# EAGLE design kelvin_1wire_B (EAGLE 6.6.0)
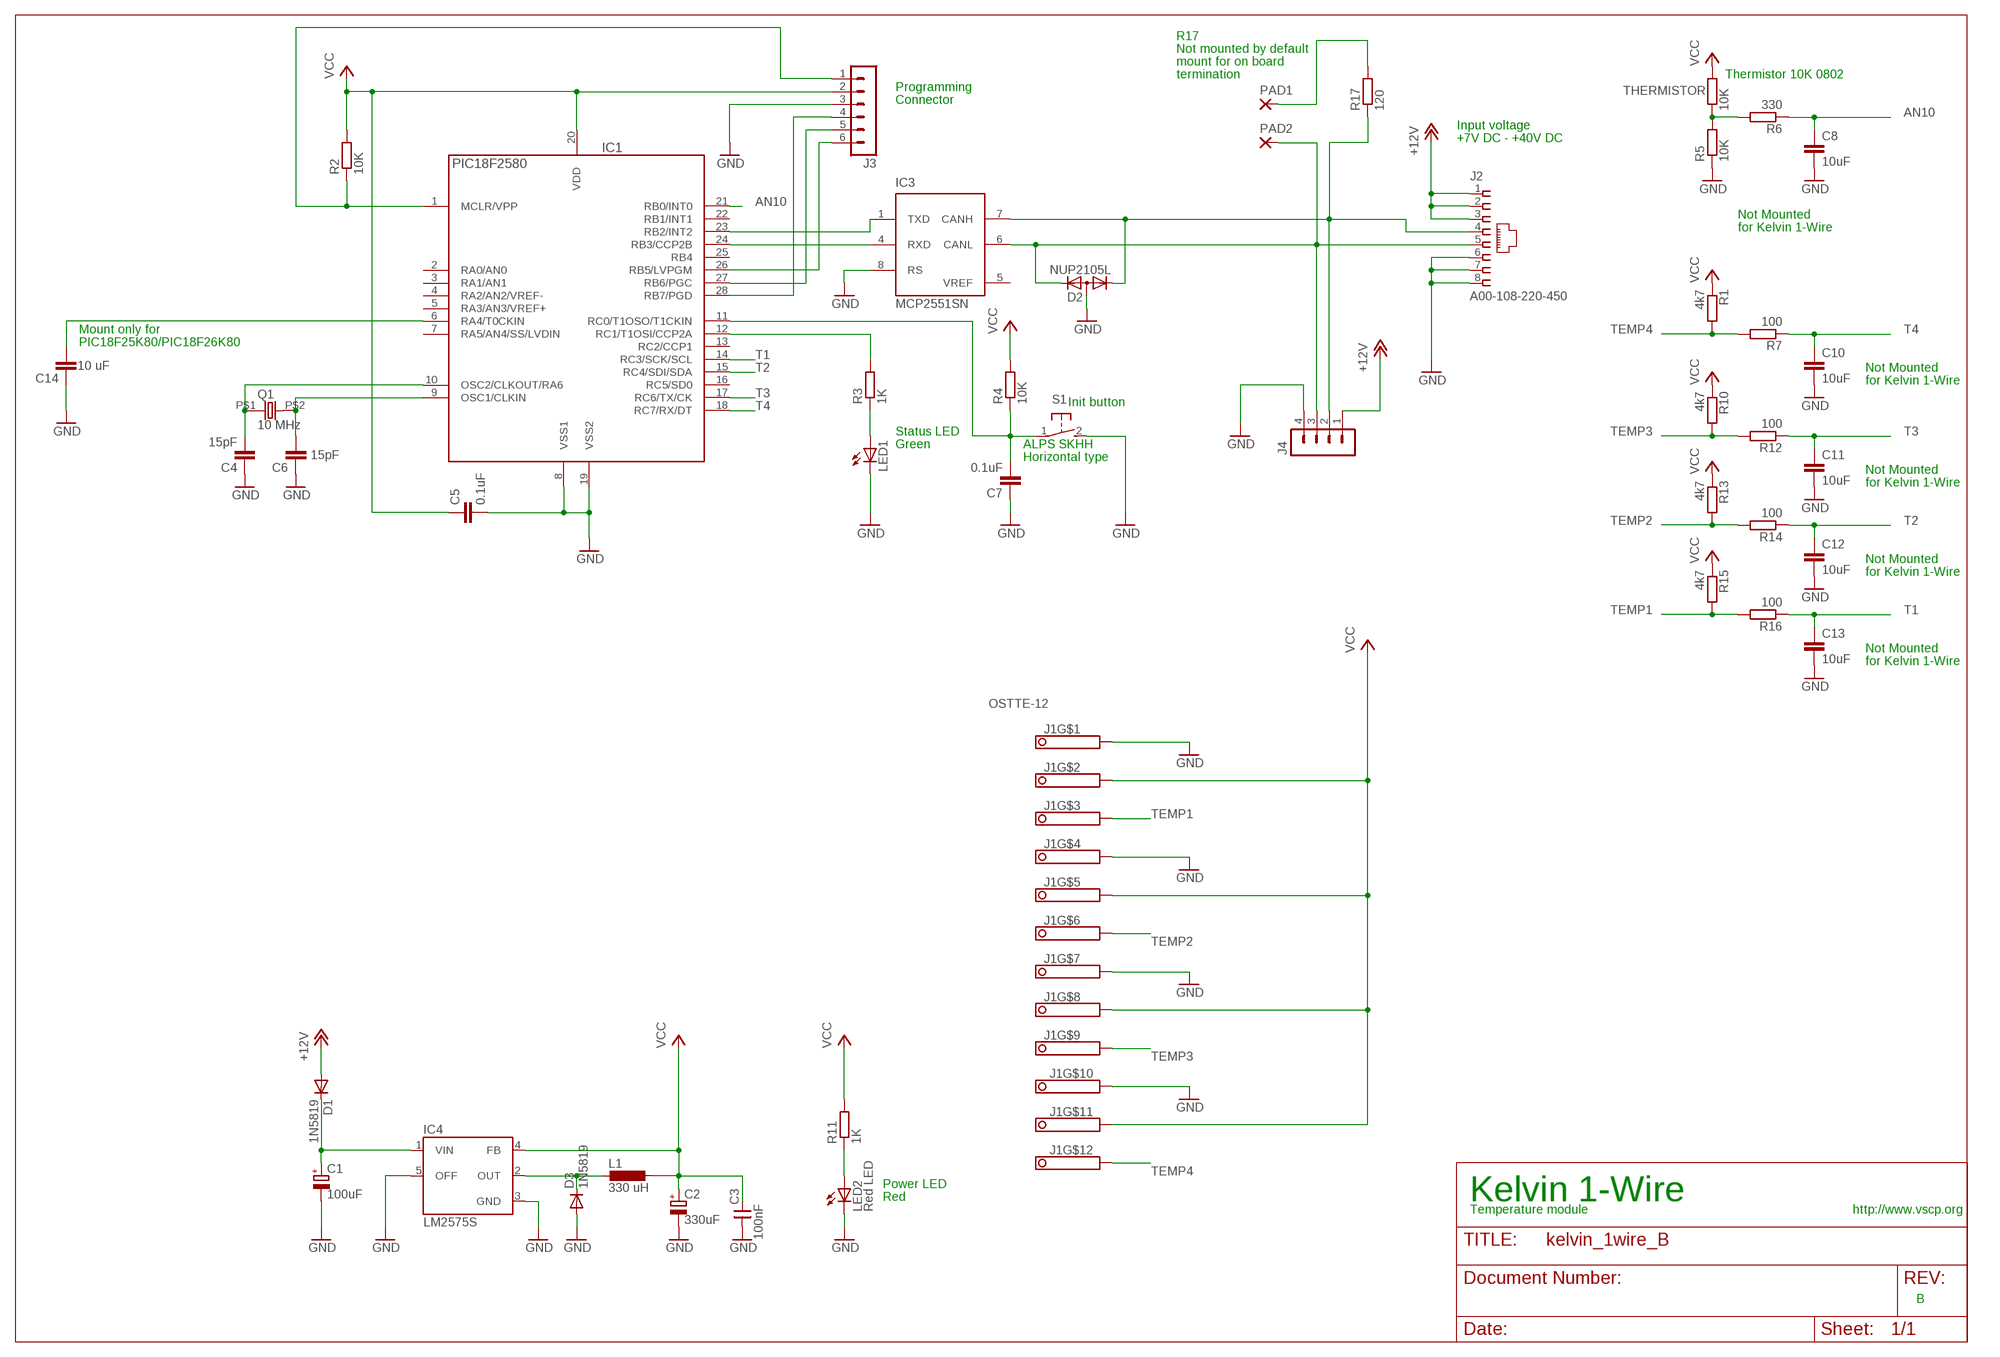
[diagram p0: schematic, sheet 1]

## Parts
C1  100uF  CPOL-EUD  [PANASONIC_D]
C2  330uF  CPOL-EUD  [PANASONIC_D]
C3  100nF  CNP-0805  [0805]
C4  15pF  C-EUC0805  [C0805]
C5  0.1uF  C-EUC0805  [C0805]
C6  15pF  C-EUC0805  [C0805]
C7  0.1uF  C-EUC0805  [C0805]
C8  10uF  C-EUC0805  [C0805]
C10  10uF  C-EUC0805  [C0805]
C11  10uF  C-EUC0805  [C0805]
C12  10uF  C-EUC0805  [C0805]
C13  10uF  C-EUC0805  [C0805]
C14  10 uF  C-EUC0805  [C0805]
D1  1N5819  DIODE-SOD123  [SOD123]
D2  NUP2105L  DIODE-2CA|ACSOT23  [SOT23]
D3  1N5819  DIODE-SOD123  [SOD123]
IC1  PIC18F2580  PIC18LF252-I/SO  [SO28]
IC3  MCP2551SN  [SO-08]
IC4  LM2575S  [TO263-5]
J1  OSTTE-12  [PINHEAD-12]
J2  A00-108-220-450  [RJ-45]
J3  MA06-1  [MA06-1]
J4  MA04-1  [MA04-1]
L1  330 uH  DO3316P  [DO3316P]
LED1  LEDCHIP-LED0805  [CHIP-LED0805]
LED2  Red LED  LEDCHIP-LED0805  [CHIP-LED0805]
PAD1  1,6/0,8  [1,6/0,8]
PAD2  1,6/0,8  [1,6/0,8]
Q1  10 MHz  HC-49S  [9C]
R1  4k7  R-EU_R0805  [R0805]
R2  10K  R-EU_R0805  [R0805]
R3  1K  R-EU_R0805  [R0805]
R4  10K  R-EU_R0805  [R0805]
R5  10K  R-EU_R0805  [R0805]
R6  330  R-EU_R0805  [R0805]
R7  100  R-EU_R0805  [R0805]
R10  4k7  R-EU_R0805  [R0805]
R11  1K  R-EU_R0805  [R0805]
R12  100  R-EU_R0805  [R0805]
R13  4k7  R-EU_R0805  [R0805]
R14  100  R-EU_R0805  [R0805]
R15  4k7  R-EU_R0805  [R0805]
R16  100  R-EU_R0805  [R0805]
R17  120  R-EU_R0805  [R0805]
S1  31-XX  [B3F-31XX]
THERMISTOR  10K  R-EU_R0805  [R0805]

## Nets
+12V: D1.A J2.1 J2.2 J2.3 J4.1
AN10: C8.1 IC1.21(RB0/INT0) R6.1
CANL: D2.2(K2) IC3.6(CANL) J2.5 J4.3 PAD2.1(P)
GND: C1.- C2.- C3.1 C4.1 C5.2 C6.1 C7.1 C8.2 C10.2 C11.2 C12.2 C13.2 C14.1 D2.3(A) D3.A IC1.8(VSS1) IC1.19(VSS2) IC3.8(RS) IC4.3(GND) IC4.5(OFF) J1.1 J1.4 J1.7 J1.10 J2.6 J2.7 J2.8 J3.3 J4.4 LED1.C LED2.C R5.1 S1.2(S)
N$1: D3.C IC4.2(OUT) L1.1
N$2: C4.2 IC1.10(OSC2/CLKOUT/RA6) Q1.P$1
N$3: C1.+ D1.C IC4.1(VIN)
N$4: IC1.12(RC1/T1OSI/CCP2A) R3.2
N$5: LED1.A R3.1
N$6: C7.2 IC1.11(RC0/T1OSO/T1CKIN) R4.1 S1.1(P)
N$7: C6.2 IC1.9(OSC1/CLKIN) Q1.P$2
N$8: R5.2 R6.2 THERMISTOR.1
N$9: C14.2 IC1.6(RA4/T0CKIN)
N$11: PAD1.1(P) R17.2
N$12: IC1.1(MCLR/VPP) J3.1 R2.1
N$13: IC1.28(RB7/PGD) J3.4
N$14: IC1.27(RB6/PGC) J3.5
N$15: IC1.26(RB5/LVPGM) J3.6
N$20: LED2.A R11.1
N$22: D2.1(K1) IC3.7(CANH) J2.4 J4.2 R17.1
RXCAN: IC1.24(RB3/CCP2B) IC3.4(RXD)
T1: C13.1 IC1.14(RC3/SCK/SCL) R16.1
T2: C12.1 IC1.15(RC4/SDI/SDA) R14.1
T3: C11.1 IC1.17(RC6/TX/CK) R12.1
T4: C10.1 IC1.18(RC7/RX/DT) R7.1
TEMP1: J1.3 R15.2 R16.2
TEMP2: J1.6 R13.2 R14.2
TEMP3: J1.9 R10.2 R12.2
TEMP4: J1.12 R1.2 R7.2
TXCAN: IC1.23(RB2/INT2) IC3.1(TXD)
VCC: C2.+ C3.2 C5.1 IC1.20(VDD) IC4.4(FB) J1.2 J1.5 J1.8 J1.11 J3.2 L1.2 R1.1 R2.2 R4.2 R10.1 R11.2 R13.1 R15.1 THERMISTOR.2
Unconnected: IC1.2(RA0/AN0) IC1.3(RA1/AN1) IC1.4(RA2/AN2/VREF-) IC1.5(RA3/AN3/VREF+) IC1.7(RA5/AN4/SS/LVDIN) IC1.13(RC2/CCP1) IC1.16(RC5/SD0) IC1.22(RB1/INT1) IC1.25(RB4)

## Notes on the sheet
- R17
- Not mounted by default
- mount for on board
- termination | Thermistor 10K 0802
- Programming
- Connector
- Input voltage
- +7V DC - +40V DC
- Not Mounted
- for Kelvin 1-Wire
- Mount only for
- PIC18F25K80/PIC18F26K80
- Not Mounted
- for Kelvin 1-Wire
- Init button
- Status LED
- Green | ALPS SKHH
- Horizontal type
- Not Mounted
- for Kelvin 1-Wire
- Not Mounted
- for Kelvin 1-Wire
- Not Mounted
- for Kelvin 1-Wire
- Power LED
- Red | Kelvin 1-Wire
- Temperature module | http://www.vscp.org
- B

## Power pins joined to a net without a drawn wire
GND: IC3.2(VSS)
VCC: IC3.3(VDD)
VREF: IC3.5(VREF)

## Library data of the parts
C1 C2 = rcl:CPOL-EU: POLARIZED CAPACITOR, European symbol
C3 = cap-master:CNP-: NON-POLARIZED CAP
C4-C8 C10-C14 = rcl:C-EU: CAPACITOR, European symbol
D1 D3 = diode:DIODE-: DIODE
D2 = diode:DIODE-2CA|AC: Dual DIODE Cathode-Anode|Anode-Cathode
IC1 = pic_olin:PIC18*F252-?: 18F252, 28 pin, 32Kb prog, 1536 data, 256 EEPROM
IC3 = microchip_can:MCP2551: High Speed CAN tranceiver
IC4 = v-reg-3:LM2575: National Semiconductor <http://www.national.com> 1.0A "Simple Switcher"(c) 52kHz, Vout 1.23-37V (HV: 57V), Vin 40V (HV: 60V), 50µA standby current
J1 = vscpcan:OSTTE-12
J2 = vscpcan:A00-108-220-450
J3 = con-lstb:MA06-1: PIN HEADER; OC_FARNELL: unknown; OC_NEWARK: unknown
J4 = con-lstb:MA04-1: PIN HEADER; OC_FARNELL: unknown; OC_NEWARK: unknown
L1 = inductor-coilcraft:DO3316P: COILCRAFT; OC_FARNELL: unknown; OC_NEWARK: unknown
LED1 LED2 = led:LED: LED OSRAM: - CHIPLED LG R971, LG N971, LY N971, LG Q971, LY Q971, LO R971, LY R971 LH N974, LH R974 LS Q976, LO Q976, LY Q976 LO Q996 - Hyper CHIPLED LW Q18S LB Q993, LB Q99A, LB R99A - SideLED LS A670, LO A670, LY A670, LG A670, LP A670 LB A673, LV A673, LT A673, LW A673 LH A674 LY A675 LS A676, LA A676, LO A676, LY A676, LW A676 LS A679, LY A679, LG A679 - Hyper Micro SIDELED® LS Y876, LA Y876, LO Y876, LY Y876 LT Y87S - SmartLED LW L88C, LW L88S LB L89C, LB L89S, LG L890 LS L89K, LO L89K, LY L89K LS L896, LA L896, LO L896, LY L896 - TOPLED LS T670, LO T670, LY T670, LG T670, LP T670 LSG T670, LSP T670, LSY T670, LOP T670, LYG T670 LG T671, LOG T671, LSG T671 LB T673, LV T673, LT T673, LW T673 LH T674 LS T676, LA T676, LO T676, LY T676, LB T676, LH T676, LSB T676, LW T676 LB T67C, LV T67C, LT T67C, LS T67K, LO T67K, LY T67K, LW E67C LS E67B, LA E67B, LO E67B, LY E67B, LB E67C, LV E67C, LT E67C LW T67C LS T679, LY T679, LG T679 LS T770, LO T770, LY T770, LG T770, LP T770 LB T773, LV T773, LT T773, LW T773 LH T774 LS E675, LA E675, LY E675, LS T675 LS T776, LA T776, LO T776, LY T776, LB T776 LHGB T686 LT T68C, LB T68C - Hyper Mini TOPLED® LB M676 - Mini TOPLED Santana® LG M470 LS M47K, LO M47K, LY M47K Source: http://www.osram.convergy.de LUXEON: - LUMILED® LXK2-PW12-R00, LXK2-PW12-S00, LXK2-PW14-U00, LXK2-PW14-V00 LXK2-PM12-R00, LXK2-PM12-S00, LXK2-PM14-U00 LXK2-PE12-Q00, LXK2-PE12-R00, LXK2-PE12-S00, LXK2-PE14-T00, LXK2-PE14-U00 LXK2-PB12-K00, LXK2-PB12-L00, LXK2-PB12-M00, LXK2-PB14-N00, LXK2-PB14-P00, LXK2-PB14-Q00 LXK2-PR12-L00, LXK2-PR12-M00, LXK2-PR14-Q00, LXK2-PR14-R00 LXK2-PD12-Q00, LXK2-PD12-R00, LXK2-PD12-S00 LXK2-PH12-R00, LXK2-PH12-S00 LXK2-PL12-P00, LXK2-PL12-Q00, LXK2-PL12-R00 Source: www.luxeon.com KINGBRIGHT: KA-3528ASYC Source: www.kingbright.com
PAD1 PAD2 = wirepad:1,6/0,8: THROUGH-HOLE PAD
Q1 = vscpcan:HC-49S: Digikey 887-1050-1-nd
R1-R7 R10-R17 THERMISTOR = rcl:R-EU_: RESISTOR, European symbol
S1 = switch-omron:31-XX: OMRON SWITCH; MPN: B3F-3100; OC_FARNELL: 959704; OC_NEWARK: 36M3582

## Board
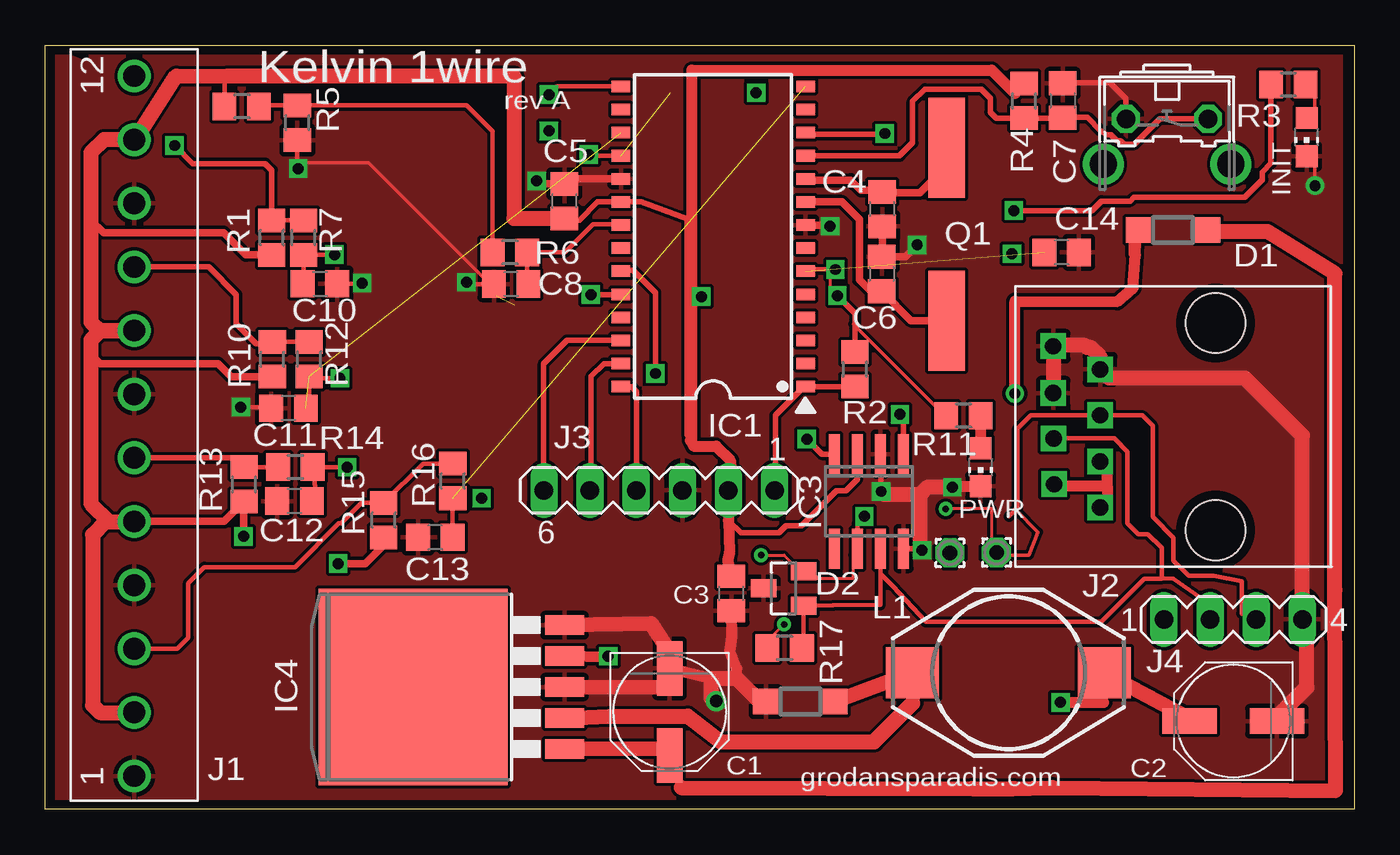
[diagram p1: board, top side]
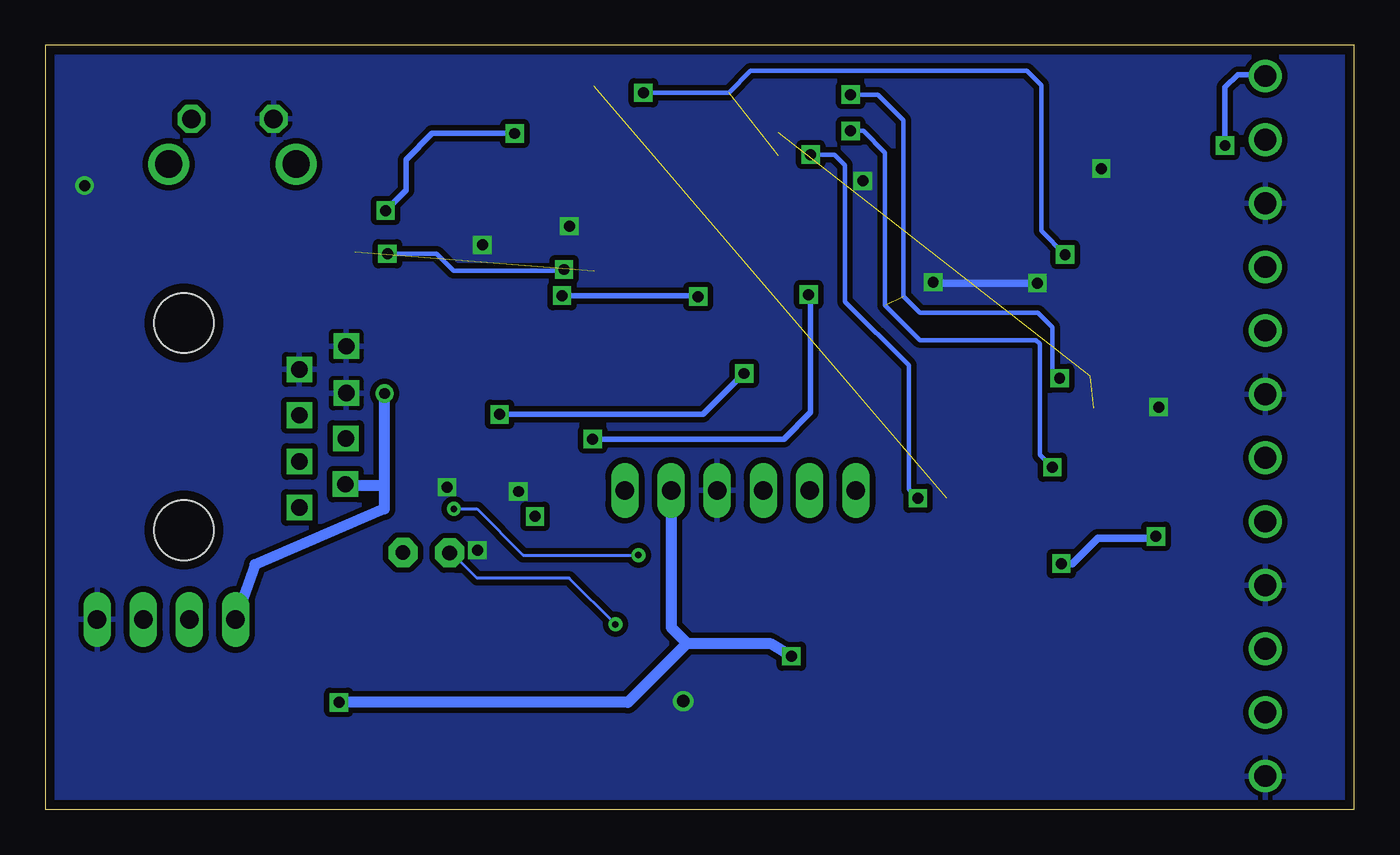
[diagram p2: board, bottom side, seen from below]

Size 72 x 42 mm. Coordinates in mm from the lower left corner, seen from the top.
Outline: 0,0 0,42 72,42 72,0 0,0
Copper layers (1*16): Top 0.0356mm / dielectric 1.5011mm / Bottom 0.0356mm
Design rules "SilverCircuits": minimum track width 7mil, minimum drill 14mil, track to track 7mil, track to pad 7mil, pad to pad 7mil, via to via 7mil, smd to smd 0mil, copper to edge 20mil, drill to drill 8mil, minimum pad ring 10mil, minimum via ring 8mil, stop-mask expansion 4mil, vias tented up to drill 0mil, thermal gap 10mil

### Footprints (pad centres in the part's own frame; a part is rotated, then mirrored left to right if it is on the bottom)
PANASONIC_D = smd 3 x 1.4: + 2.4,0; - -2.4,0
0805 = smd 1.27 x 1.524: 1 -0.953,0; 2 0.953,0
C0805 = smd 1.3 x 1.5: 1 -0.95,0; 2 0.95,0
SOD123 = smd 1.4 x 1.4: A 1.9,0; C -1.9,0
SOT23 = smd 1 x 1.4: 1 -0.95,-1.1; 2 0.95,-1.1; 3 0,1.1
SO28 = smd 0.635 x 1.016: 1 -8.255,-5.08; 2 -6.985,-5.08; 3 -5.715,-5.08; 4 -4.445,-5.08; 5 -3.175,-5.08; 6 -1.905,-5.08; 7 -0.635,-5.08; 8 0.635,-5.08; 9 1.905,-5.08; 10 3.175,-5.08; 11 4.445,-5.08; 12 5.715,-5.08; 13 6.985,-5.08; 14 8.255,-5.08; 15 8.255,5.08; 16 6.985,5.08; 17 5.715,5.08; 18 4.445,5.08; 19 3.175,5.08; 20 1.905,5.08; 21 0.635,5.08; 22 -0.635,5.08; 23 -1.905,5.08; 24 -3.175,5.08; 25 -4.445,5.08; 26 -5.715,5.08; 27 -6.985,5.08; 28 -8.255,5.08
SO-08 = smd 0.6 x 2.2: 1 -1.905,-2.6; 2 -0.635,-2.6; 3 0.635,-2.6; 4 1.905,-2.6; 5 1.905,2.6; 6 0.635,2.6; 7 -0.635,2.6; 8 -1.905,2.6
TO263-5 = smd 1.067 x 2.159: 1 -3.404,-5.791; 2 -1.702,-5.791; 3 0,-5.791; 4 1.702,-5.791; 5 3.404,-5.791 | smd 10.8 x 10.41: 6 0,2.54
PINHEAD-12 = drill 1.2: 1 -17.5,0; 2 -14,0; 3 -10.5,0; 4 -7,0; 5 -3.5,0; 6 0,0; 7 3.5,0; 8 7,0; 9 10.5,0; 10 14,0; 11 17.5,0; 12 21,0
RJ-45 = drill 0.9 square: 1 -4.45,6.35; 2 -3.17,8.89; 3 -1.92,6.36; 4 -0.65,8.91; 5 0.62,6.35; 6 1.84,8.93; 7 3.14,6.35; 8 4.42,8.93 | hole 3.3: -5.7,0; 5.7,0
MA06-1 = drill 1.016 long: 1 -6.35,0; 2 -3.81,0; 3 -1.27,0; 4 1.27,0; 5 3.81,0; 6 6.35,0
MA04-1 = drill 1.016 long: 1 -3.81,0; 2 -1.27,0; 3 1.27,0; 4 3.81,0
DO3316P = smd 2.92 x 2.79: 1 -5.28,0; 2 5.28,0
CHIP-LED0805 = smd 1.2 x 1.2: A 0,-1.05; C 0,1.05
1,6/0,8 = drill 0.813 pad 1.6 octagon: 1 0,0
9C = smd 5.5 x 2: P$1 -4.74,0; P$2 4.76,0
R0805 = smd 1.3 x 1.5: 1 -0.95,0; 2 0.95,0
B3F-31XX = drill 1.016 octagon: 1 -2.261,-1.245; 2 2.261,-1.245 | drill 1.499 pad 2.159: 3 -3.505,1.245; 4 3.505,1.245

### Placement (x,y rotation side)
C1  34.34,5.34 270 top
C2  65.36,4.84 180 top
C3  37.74,11.86 90 top
C4  46.04,33 90 top
C5  28.55,33.44 90 top
C6  46.01,29.43 270 top
C7  55.97,38.97 270 top
C8  25.62,28.88 180 top
C10  15.1,28.89 0 top
C11  13.37,22.05 180 top
C12  13.7,16.94 180 top
C13  21.45,14.95 180 top
C14  55.91,30.62 180 top
D1  62.04,31.86 180 top
D2  40.61,12.14 90 top
D3  41.53,5.91 180 top
IC1  36.74,31.49 90 top
IC3  45.31,16.93 180 top
IC4  22.77,6.71 90 top
J1  4.88,19.32 90 top
J2  64.38,21.04 90 top
J3  33.77,17.53 180 top
J4  65.35,10.43 0 top
L1  52.99,7.5 0 top
LED1  69.39,36.96 180 top
LED2  51.45,18.8 180 top
PAD1  49.76,14.09 0 top
PAD2  52.33,14.11 0 top
Q1  49.58,31.63 270 top
R1  12.45,31.43 90 top
R2  44.54,24.19 90 top
R3  68.38,39.85 180 top
R4  53.84,38.95 90 top
R5  13.86,37.75 90 top
R6  25.55,30.62 180 top
R7  14.2,31.43 90 top
R10  12.48,24.74 90 top
R11  50.51,21.64 180 top
R12  14.51,24.75 90 top
R13  10.93,17.86 90 top
R14  13.75,18.81 180 top
R15  18.61,15.89 90 top
R16  22.41,18.05 90 top
R17  40.67,8.86 180 top
S1  61.71,36.72 180 top
THERMISTOR  10.8,38.65 180 top

### Tracks (layer width: path | path; a pad name or v marks a point on that pad's centre or on a via)
+12V  (via drill 0.6)
  Top 0.203: J2.2 55.88,17.78 | D1.A 59.69,31.75 59.69,30.48 59.97,30.47
  Top 0.406: D1.A 59.82,31.84
  Top 0.61: 55.88,17.78 58.42,17.78 | 58.42,17.78 58.42,19.05 J2.3 | 58.42,17.78 58.42,16.51 J2.1 | 60.01,31.97 59.97,30.47 59.83,28.66 58.97,27.91 53.34,27.94 v53.34,22.86
  Bottom 0.61: 53.34,17.78 53.34,16.51 60.47,13.44 J4.1 | 53.34,17.78 v53.34,22.86 | 53.34,17.78 55.88,17.78 J2.2
AN10
  Top 0.254: IC1.21 31.62,32.16 30.12,32.16 28.58,30.62 R6.1 26.5,28.95 C8.1
CANL  (via drill 0.36, 0.6)
  Top 0.178: 41.91,12.7 44.45,12.7 44.45,13.97 | 41.91,12.7 40.64,13.97 v39.37,13.97 | v49.53,16.51 52.07,16.51 52.07,13.97 | 41.91,12.7 D2.2
  Top 0.203: D2.2 42.45,12.74 | 44.45,13.97 IC3.6 | PAD2.1 52.07,13.97 54.11,13.97 54.61,15.24 53.38,16.46 53.34,16.51
  Top 0.254: J4.3 65.81,10.75 65.81,12.53 64.29,12.83 62.9,12.83 62.06,13.67 62.06,14.93 60.92,16.07 60.92,21.09 60.35,21.66 J2.5 54.21,21.66 53.48,20.93 53.48,16.56 53.38,16.46 53.02,16.1 | v45.06,16.1 44.67,15.71 IC3.6
  Bottom 0.178: v39.37,13.97 45.72,13.97 48.26,16.51 v49.53,16.51
GND  (via drill 0.6, 0.7)
  Top 0.203: v69.85,34.29 69.85,35.56 LED1.C | C8.2 24.13,29.21 17.78,35.56 13.97,35.56 v13.9,35.23
  Top 0.254: 36.63,7.18 36.63,7.36 | C8.2 23.26,28.88 v23.16,28.98 | R5.1 13.86,35.5 v13.9,35.23 | C10.2 17.38,28.89 v17.42,28.93 | 12.48,22.11 C11.2 12.36,22.11 v10.75,22.11 | C13.2
  Top 0.305: IC3.8 48.14,14.33 v48.23,14.24 | v45.98,17.47 45.98,19.5 IC3.2 | S1.2 59.45,39.06 58.55,39.96 56.01,39.96 C7.1
  Top 0.406: IC1.19 28.82,34.66 C5.2 27.19,34.39 v27.03,34.55 | 45.97,32.12 C4.1 46.04,30.41 C6.1 47.31,30.38 v47.96,31.03 | IC1.8 43.1,32.12 v43.17,32.06
  Top 0.61: 34.65,6.72 34.33,6.65 34.62,7.21 34.65,7.18 | 34.65,7.18 34.7,7.13 | 34.65,7.18 C1.- | 39.42,5.79 39.33,5.88 D3.A 39.48,5.91 | C1.- 36.63,7.18 | 39.48,5.91 39.58,5.81 | 39.48,5.91 38.93,6.46 | 34.44,7.15 34.34,7.05 | C1.- 34.44,7.15 | 34.47,8.45 34.47,7.18 34.44,7.15 | 36.63,6.09 v36.91,5.94 | 38.02,7.18 38.02,7.75 37.66,8.68 37.76,9.48 C3.1 | 49.95,17.75 LED2.C
  Top 0.813: IC4.3 34.65,6.72 | 39.33,5.88 38.02,7.18 36.63,7.18 36.63,6.09 | IC4.5 33.34,10.21 34.47,8.45 | C2.- 67.76,5.06 69.4,6.7 69.4,10.19 J4.4 69.16,20.54 66,23.7 58.51,23.7 J2.7 58.03,24.87 57.5,25.4 57.3,25.4 57.2,25.5 55.49,25.5 J2.8 J2.6 | v49.9,17.7 48.5,17.7 48.1,17.3 | 48.1,17.3 46.15,17.3 v45.98,17.47 | 48.1,17.3 48.1,14.37 v48.23,14.24
  Bottom 0.406: v17.42,28.93 23.16,28.93 v23.16,28.98
  pour Bottom (isolate 0.305): -0.3,1.58 1.36,-1.77 71.34,-2.14 73.38,1.23 73.1,34.4 71.52,43.66 0.13,43.56 -0.79,33.98
  pour Top: 0.97,41.52 0.56,41.52 0.56,0.32 71.6,0.32 71.6,0.81 71.28,0.81 71.28,41.6 2.5,41.6 2.5,40.95
N$1
  Top 0.61: 47.83,5.86 47.78,5.91 L1.1 47.71,5.81 | IC4.2 28.65,4.95 28.53,4.89
  Top 0.813: L1.1 D3.C | 47.71,5.81 45.6,3.7 37.16,3.7 35.35,5.11 31.02,5.1 28.61,5 28.65,4.95
N$2
  Top 0.406: Q1.P$1 49.58,35.37 48.1,33.89 45.66,33.89 45.52,34.03 | 45.52,34.03 45.96,34.03 C4.2 | 45.52,34.03 44.87,34.03 44.3,34.6 41.88,34.6 IC1.10
N$3
  Top 0.406: 34.35,3.36 C1.+ 34.97,1.18 | D1.C 64.48,31.86 64.58,31.76
  Top 0.813: IC4.1 34.35,3.36 | 64.58,31.76 67.25,31.76 70.95,29.46 70.95,12.05 70.98,1.02 55.42,1.18 53.07,1.13 53.29,1.12 50.97,1.13 34.97,1.18
N$4  (via drill 0.6)
  Top 0.305: IC1.12 41.92,37.2 42.01,37.12 46.14,37.12 v46.18,37.16 | v53.28,32.92 57.58,32.92 58.1,33.44 59.69,33.44 59.89,33.64 65.98,33.64 66.96,34.62 66.96,35.04 67.43,35.51 R3.2
  Bottom 0.305: v46.18,37.16 50.73,37.16 52.17,35.72 52.17,34.03 v53.28,32.92
N$5
  Top 0.203: 69.85,39.37 69.85,38.1 LED1.A
  Top 0.254: 69.85,39.37 R3.1
N$6
  Top 0.305: IC1.11 41.84,35.92 46.99,35.92 47.71,36.64 47.71,38.92 48.39,39.6 51.49,39.6 51.98,39.11 51.98,38.33 52.31,38 R4.1 55.95,38 C7.2 55.99,38.04 57.32,38.04 58.07,37.29 58.13,37.29 58.33,37.09 58.62,37.09 58.95,36.76 59.14,36.76 59.33,36.57 59.92,36.57 61.31,37.97 S1.1
N$7
  Top 0.406: Q1.P$2 47.62,26.87 C6.2 45.41,28.48 44.78,29.11 44.78,32.45 43.83,33.4 IC1.9
N$8
  Top 0.254: THERMISTOR.1 11.8,38.7 R5.2 23.16,38.71 24.6,37.27 R6.2
N$9  (1 unrouted)
N$11  (via drill 0.36)
  Top 0.178: v40.64,10.16 39.37,8.89 R17.2
  Bottom 0.178: v40.64,10.16 43.18,12.7 48.26,12.7 49.53,13.97 PAD1.1
N$12
  Top 0.305: IC1.1 R2.1 41.74,23.24 40.16,21.66 40.16,17.57 J3.1
N$13
  Top 0.305: IC1.28 32.24,23.23 32.52,22.96 32.52,17.55 J3.4
N$14
  Top 0.305: IC1.27 30.73,24.5 30.03,23.8 30.03,17.6 J3.5
N$15
  Top 0.305: IC1.26 28.68,25.77 27.41,24.5 J3.6
N$20
  Top 0.61: R11.1 LED2.A
N$22
  Top 0.254: 45.95,12.95 IC3.7 | 45.95,12.95 46.61,12.28 48.43,10.3 58.1,10.3 60.46,12.66 61.37,12.66 61.41,12.7 | 61.41,12.7 61.41,14.38 60.66,15.13 60.12,15.13 59.53,15.72 59.53,19.66 58.8,20.39 J2.4 | 61.41,12.7 62.05,12.66 63.78,11.47 J4.2 | 45.95,12.95 45.93,12.93 45.93,11.23 43.34,11.2 D2.1 41.71,8.95 R17.1
  Top 0.305: IC3.7 45.92,14.3
RXCAN  (via drill 0.6)
  Top 0.305: IC3.4 42.71,19.53 v41.89,20.35 | v30.01,28.3 31.64,28.3 IC1.24
  Bottom 0.305: v41.89,20.35 31.37,20.35 29.9,21.82 29.9,28.19 v30.01,28.3
T1  (1 unrouted)
  Top 0.254: C13.1 R16.1
T2  (via drill 0.6)  (1 unrouted)
  Top 0.254: C12.1 14.82,16.75 14.85,16.71 14.89,17.29 R14.1 v16.6,18.8 | 27.8,37.2 v27.7,37.3 | 14.51,22.24 14.51,23.3 14.91,23.7 v16.2,23.7 | IC1.15 28.14,39.74 v27.7,39.3
  Bottom 0.254: v27.7,37.3 27,37.3 25.8,36.1 25.8,27.7 23.9,25.8 17.5,25.8 17.3,25.6 17.3,19.5 v16.6,18.8 | v27.7,39.3 26.2,39.3 24.8,37.9 24.8,28.2 23.9,27.3 17.4,27.3 16.6,26.5 16.6,24.1 v16.2,23.7
T3  (2 unrouted)
T4  (via drill 0.6)  (1 unrouted)
  Top 0.254: C10.1 14.2,28.94 R7.1 14.22,30.5 v15.9,30.5 | 39.45,39.74 v39.1,39.4 | IC1.18 29.96,35.94 v29.9,36
  Bottom 0.254: v39.1,39.4 34.4,39.4 33.2,40.6 18,40.6 17.2,39.8 17.2,31.8 v15.9,30.5 | v29.9,36 28.6,36 28,35.4 28,27.9 24.5,24.4 24.5,17.6 v24,17.1
TEMP1
  Top 0.254: R16.2 20.77,19 R15.2 17.4,16.84 16.27,15.71 16.13,15.71 13.73,13.31 8.74,13.31 7.86,12.43 7.86,9.43 7.26,8.83 J1.3
TEMP2
  Top 0.254: R13.2 R14.2
  Top 0.305: J1.6 10.42,19.32 R13.2
TEMP3
  Top 0.254: R12.2 R10.2
  Top 0.305: J1.9 8.98,29.82 10.5,28.3 10.5,26.7 11.6,25.6 12.39,25.6 R10.2
TEMP4  (via drill 0.6)
  Top 0.254: R1.2 R7.2
  Top 0.305: R1.2 12.45,35.15 12.1,35.5 8.1,35.5 v7.1,36.5
  Bottom 0.305: v7.1,36.5 7.1,39.7 6.4,40.4 4.96,40.4 J1.12
TXCAN  (via drill 0.6)
  Top 0.305: IC3.1 47.22,21.5 v47.01,21.71 | v33.56,23.96 33.56,28.41 32.32,29.65 31.73,29.65 IC1.23
  Bottom 0.305: v47.01,21.71 35.81,21.71 v33.56,23.96
VCC  (via drill 0.6)
  Top 0.178: v43.47,29.68 43.18,29.21 43.18,27.94 v43.58,28.24 | 5.03,36.93 5.08,36.83 J1.11
  Top 0.203: R11.2 49.53,21.59 44.45,26.67 44.54,26.67
  Top 0.254: 35.48,20.27 35.56,20.32 | THERMISTOR.2 9.85,40.17 10.01,40.33 | v53.18,30.54 53.26,30.62 | 41.91,29.68 v43.47,29.68
  Top 0.305: C5.1 28.65,32.39 29.38,32.39 30.39,33.4 IC1.20 32.77,33.4 35.3,32.48 35.3,28.08 | 35.3,28.08 35.3,20.58 35.48,20.27 | 37.68,17.63 J3.2 | v30.96,8.41 30.86,8.36 | IC3.3 44.67,18.14 44.03,17.5 43.51,17.5 41.59,15.58 40.74,15.58 40.35,15.19 38.26,15.19 37.58,15.87 | 58.23,5.87 L1.2 | R2.2 44.54,26.67 44.54,27.28 v43.58,28.24 | v36.09,28.19 35.41,28.19 35.3,28.08
  Top 0.406: 63.05,4.95 C2.+ | R1.1 11.02,30.48 9.8,31.7 3.2,31.7 2.5,32.4 | R10.1 10.21,23.79 9.5,24.5 3,24.5 2.5,25 | J1.5 9.84,15.82 R13.1 10.9,16.88 v10.9,15 | R15.1 18.61,14.51 17.6,13.5 v16.1,13.5
  Top 0.61: 35.48,20.27 35.66,19.96 36.9,19.96 37.68,19.18 37.68,17.63 | 30.86,8.36 IC4.4 | C3.2 37.53,13.65 37.63,14.12 37.58,15.87 J3.2 | v55.85,5.87 58.23,5.87 | 35.56,20.32 35.56,40.64 52.07,40.64 53.34,39.37 R4.2
  Top 0.813: L1.2 63.05,4.95 | C5.1 25.78,32.49 25.78,40.33 10.01,40.33 7.2,40.3 7.2,40.33 5.03,36.93 | J1.11 3.22,36.82 2.5,36.1 2.5,32.4 2.5,26.8 3,26.3 4.86,26.3 J1.8 3.02,26.32 2.5,25.8 2.5,25 2.5,16.8 3.5,15.8 | 3.5,15.8 4.86,15.8 J1.5 | 3.5,15.8 3.3,15.8 2.6,15.1 2.6,5.7 3,5.3 4.86,5.3 J1.2
  Bottom 0.254: v53.18,30.54 50.47,30.54 49.55,29.62 43.53,29.62 v43.47,29.68
  Bottom 0.305: v43.58,28.24 36.14,28.24 v36.09,28.19
  Bottom 0.406: v16.1,13.5 15.5,13.5 14.1,14.9 11,14.9 v10.9,15
  Bottom 0.61: J3.2 37.58,9.99 36.71,9.12 | 36.71,9.12 32.14,9.12 v30.96,8.41 | v55.85,5.87 39.96,5.87 36.71,9.12

### Text on the board
tNames: Kelvin 1wire | rev A | INIT | PWR | grodansparadis.com